# Altium schematic sheet POWER.SchDoc
size A4; SheetNumber: 4; SheetTotal: 4
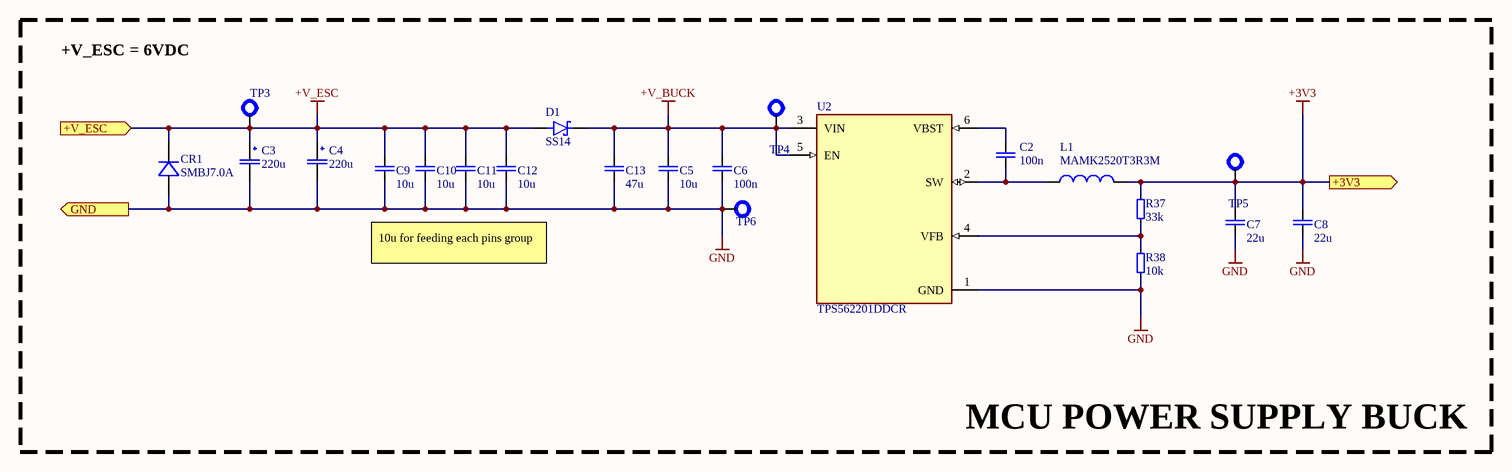
[diagram p0: POWER.SchDoc]

## Parts
C2  100n  [C0402]
C3  220u  [CAP_PC_8X10_NCH]
C4  220u  [CAP_PC_8X10_NCH]
C5  10u  [C0603]
C6  100n  [C0603]
C7  22u  [C0603]
C8  22u  [C0603]
C9  10u  [C0805]
C10  10u  [C0805]
C11  10u  [C0805]
C12  10u  [C0805]
C13  47u  [C1210]
CR1  SMBJ7.0A  [SMBJSeries_LTF]
D1  SS14  [DIOM4325X250N]
L1  MAMK2520T3R3M  [INDC2520X120N]
R37  33k  [R0402]
R38  10k  [R0402]
TP3  TP  [TP]  (value not drawn)  (no BOM)
TP4  TP  [TP]  (value not drawn)  (no BOM)
TP5  TP  [TP]  (value not drawn)  (no BOM)
TP6  TP  [TP]  (value not drawn)  (no BOM)
U2  TPS562201DDCR  [SOT95P280X110-6N]

## Ports
+3V3 (out, see Tractor2000[5C], MCU[1C]), +V_ESC (in, see Tractor2000[4C], LOAD_SWITCHES[2A]), GND (out, see Tractor2000[4C], LOAD_SWITCHES[2A], MCU[1C])

## Nets
+3V3: C7.2 C8.2 L1.2 R37.2 ; port +3V3
+V_BUCK: C5.2 C6.2 C13.2 D1.C(K) U2.3(VIN) U2.5(EN)
+V_ESC: C3.1 C4.1 C9.2 C10.2 C11.2 C12.2 CR1.1 D1.A ; port +V_ESC
GND: C3.2 C4.2 C5.1 C6.1 C7.1 C8.1 C9.1 C10.1 C11.1 C12.1 C13.1 CR1.2 R38.1 U2.1(GND) ; port GND
NetC2_1: C2.1 L1.1 U2.2(SW)
NetC2_2: C2.2 U2.6(VBST)
NetR37_1: R37.1 R38.2 U2.4(VFB)

Not connected (* = marked no-connect by the designer): TP3 1; TP4 1; TP5 1; TP6 1

## Notes on the sheet
- +V_ESC = 6VDC
- 10u for feeding each pins group
- MCU POWER SUPPLY BUCK

## Library data of the parts
C2 = CMP-00023-15: Generic SMD 0402 Ceramic Capacitor
C3 C4 = PCJ1C221MCL4GS: No Description Available; Manufacturer_Name: Nichicon; Copyright: Copyright (C) 2026 Ultra Librarian. All rights reserved.; Manufacturer_Part_Number: PCJ1C221MCL4GS
C5-C8 = CMP-00024-8: Generic 0603 SMD Ceramic Capacitor
C9-C12 = CMP-00025-5: Generic 0805 SMD Ceramic Capacitor
C13 = CMP-00027-6: Generic 1210 SMD Ceramic Capacitor
CR1 = SMBJ7.0A: Description; Manufacturer_Name: Littelfuse Inc; Copyright: Copyright (C) 2025 Ultra Librarian. All rights reserved.; Manufacturer_Part_Number: SMBJ7.0A
D1 = SS14: 1A, 40V, Schottky Rectifier; MF: Taiwan Semiconductor; SnapEDA_Link: https://www.snapeda.com/parts/SS14/taiwan/view-part/?ref=snap; Package: SMA-2 Taiwan Semiconductor; Value: *; MP: SS14; Check_prices: https://www.snapeda.com/parts/SS14/taiwan/view-part/?ref=eda
L1 = MAMK2520T3R3M: 3.3 ÂµH Shielded Drum Core, Wirewound Inductor 1.7 A 156mOhm Max 1008 (2520 Metric); MF: Taiyo Yuden; SnapEDA_Link: https://www.snapeda.com/parts/MAMK2520T3R3M/Taiyo+Yuden/view-part/?ref=snap; Package: 2520 Taiyo Yuden; Value: *; MP: MAMK2520T3R3M; Check_prices: https://www.snapeda.com/parts/MAMK2520T3R3M/Taiyo+Yuden/view-part/?ref=eda
R37 R38 = CMP-00016-11: Generic 0402 SMD Resistor
U2 = TPS562201DDCR: 4.5 V to 17 V input, 2 A output, synchronous step-down converter in Eco-mode; MF: Texas Instruments; SnapEDA_Link: https://www.snapeda.com/parts/TPS562201DDCR/Texas+Instruments/view-part/?ref=snap; Package: SOT-23-THN-6 Texas Instruments; Value: *; MP: TPS562201DDCR; Check_prices: https://www.snapeda.com/parts/TPS562201DDCR/Texas+Instruments/view-part/?ref=eda